# Altium schematic sheet ESC_A.SchDoc
size A3; SheetNumber: 7; SheetTotal: 10
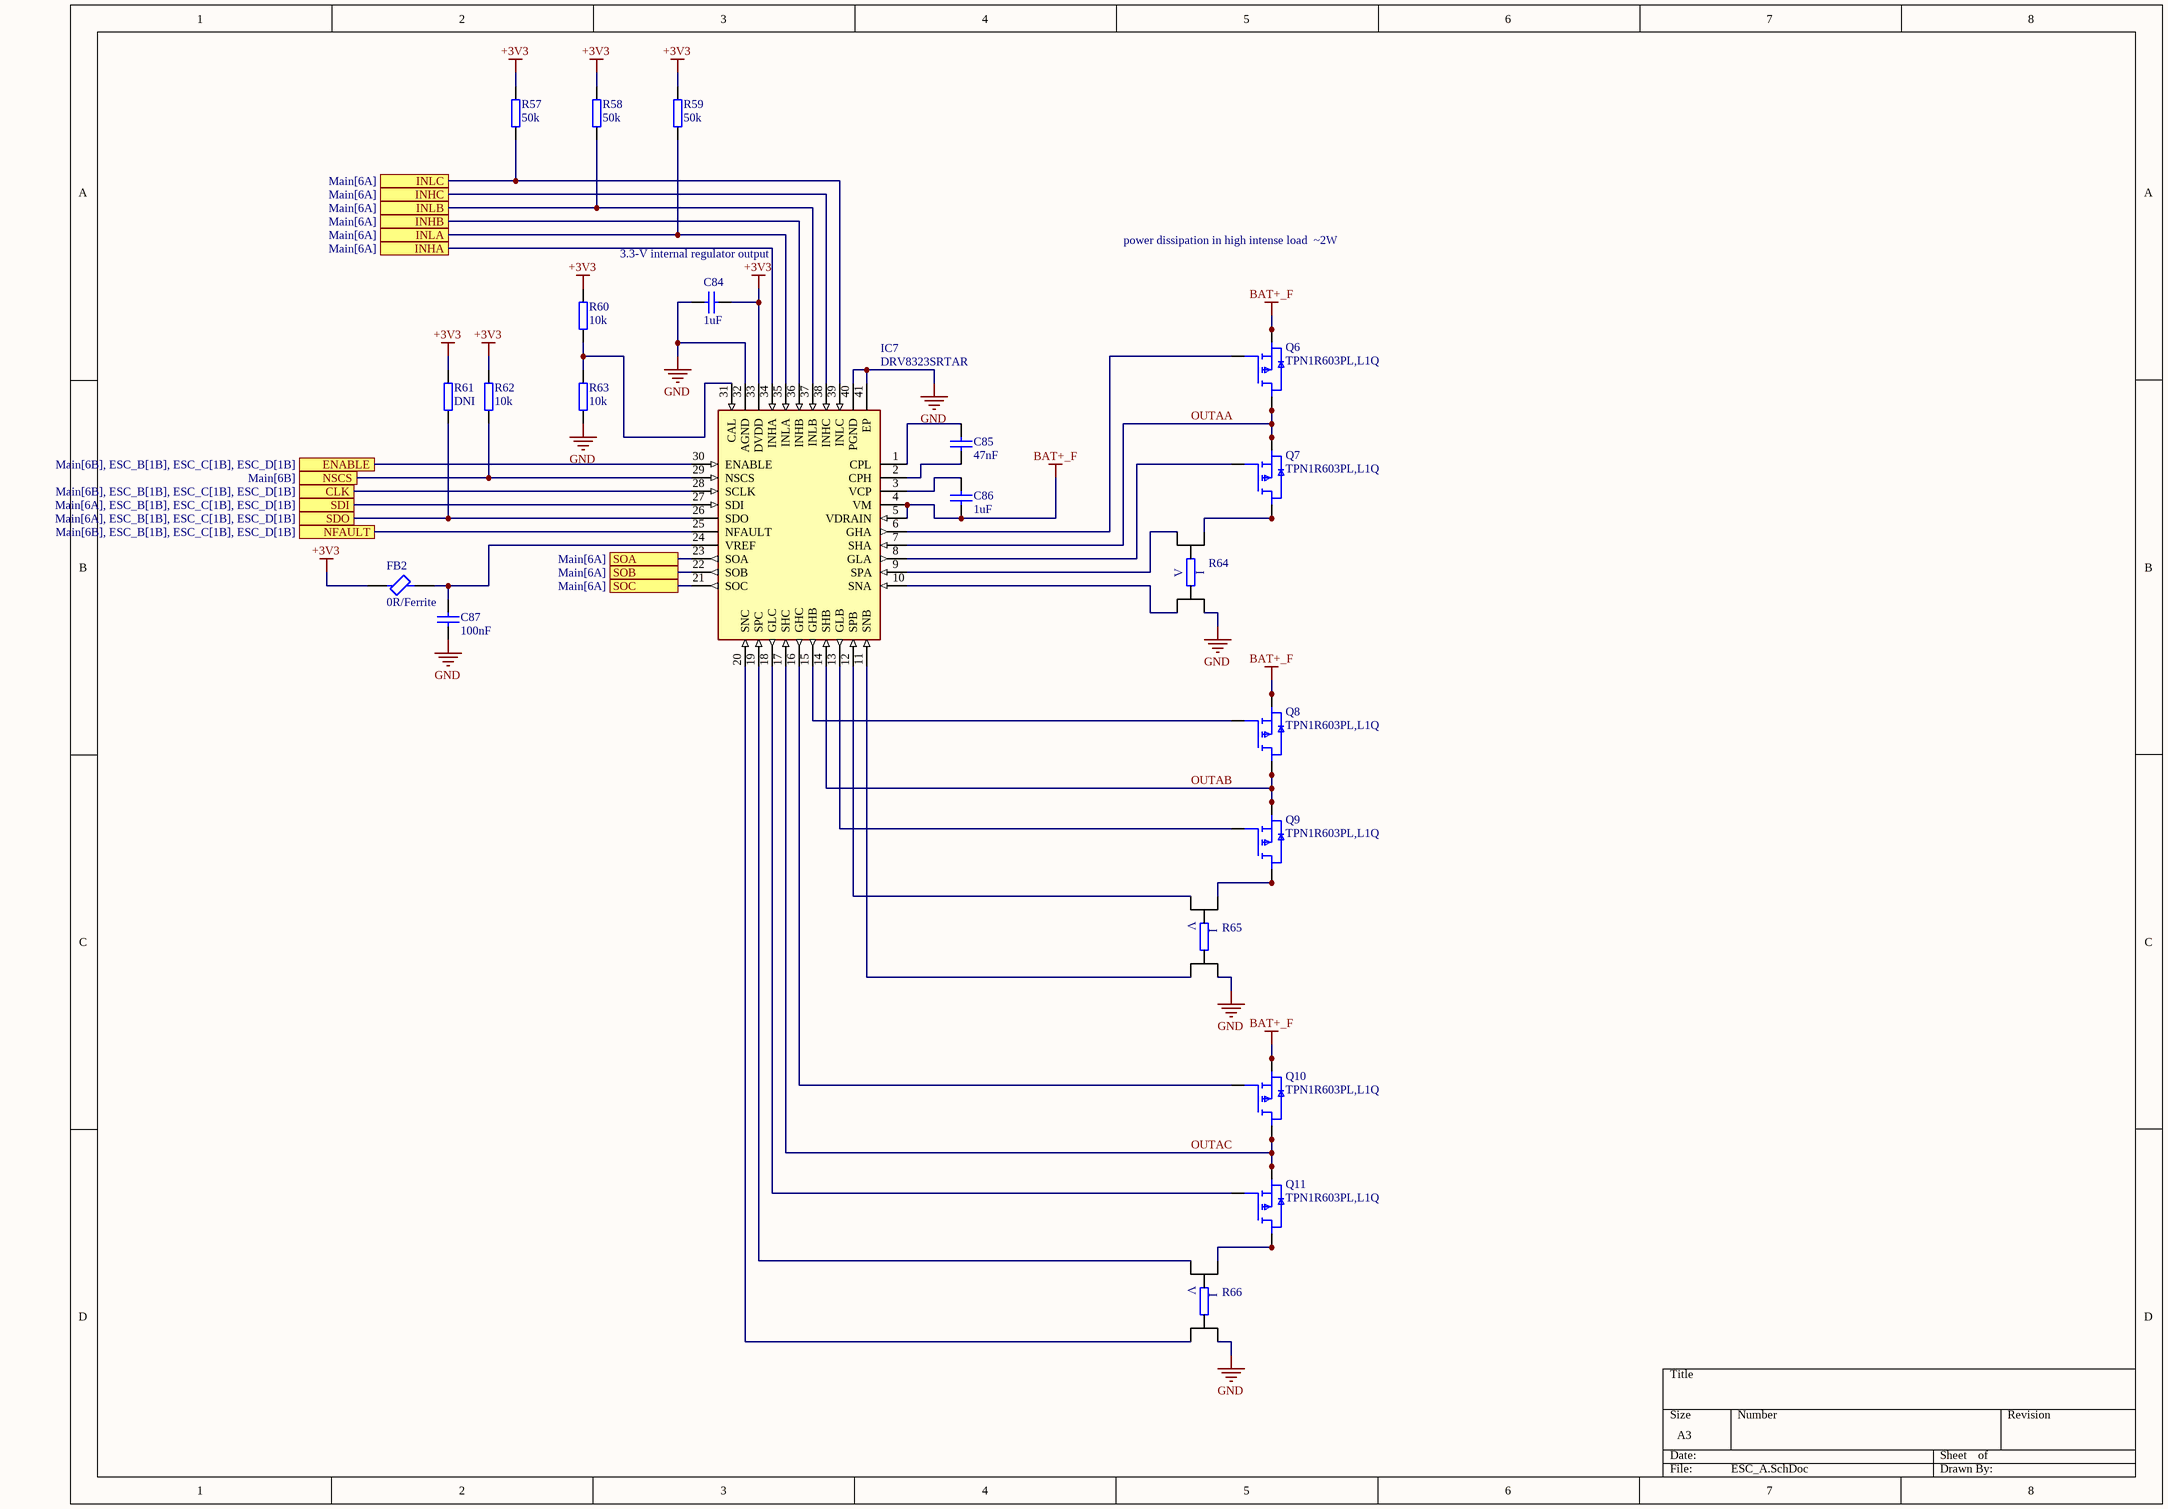
[diagram p0: ESC_A.SchDoc]

## Parts
C84  value 1uF  [CAP0402]  (hidden comment: Cap0402)
C85  value 47nF  [CAP0603]  (hidden comment: Cap0603)
C86  value 1uF  [CAP0603]  (hidden comment: Cap0603)
C87  value 100nF  [CAP0402]  (hidden comment: Cap0402)
FB2  0R/Ferrite  [NFZ15SG152SN10B]
IC7  DRV8323SRTAR  [QFN50P600X600X80-41N-D]
Q6  TPN1R603PL,L1Q  [TPN1R603PLL1Q]
Q7  TPN1R603PL,L1Q  [TPN1R603PLL1Q]
Q8  TPN1R603PL,L1Q  [TPN1R603PLL1Q]
Q9  TPN1R603PL,L1Q  [TPN1R603PLL1Q]
Q10  TPN1R603PL,L1Q  [TPN1R603PLL1Q]
Q11  TPN1R603PL,L1Q  [TPN1R603PLL1Q]
R57  value 50k  [RES0402]  (hidden comment: Res0402)
R58  value 50k  [RES0402]  (hidden comment: Res0402)
R59  value 50k  [RES0402]  (hidden comment: Res0402)
R60  value 10k  [RES0402]  (hidden comment: Res0402)
R61  value DNI  [RES0402]  (hidden comment: Res0402)
R62  value 10k  [RES0402]  (hidden comment: Res0402)
R63  value 10k  [RES0402]  (hidden comment: Res0402)
R64  WSK12161L000FEA  [WSK12161L000FEA]  (value not drawn)
R65  WSK12161L000FEA  [WSK12161L000FEA]  (value not drawn)
R66  WSK12161L000FEA  [WSK12161L000FEA]  (value not drawn)

## Ports
CLK (see Main[6B], ESC_B[1B], ESC_C[1B], ESC_D[1B]), ENABLE (see Main[6B], ESC_B[1B], ESC_C[1B], ESC_D[1B]), INHA (see Main[6A]), INHB (see Main[6A]), INHC (see Main[6A]), INLA (see Main[6A]), INLB (see Main[6A]), INLC (see Main[6A]), NFAULT (see Main[6B], ESC_B[1B], ESC_C[1B], ESC_D[1B]), NSCS (see Main[6B]), SDI (see Main[6A], ESC_B[1B], ESC_C[1B], ESC_D[1B]), SDO (see Main[6A], ESC_B[1B], ESC_C[1B], ESC_D[1B]), SOA (see Main[6A]), SOB (see Main[6A]), SOC (see Main[6A])

## Nets
+3V3: C84.2 FB2.1 IC7.33(DVDD) R57.2 R58.2 R59.2 R60.2 R61.2 R62.2
BAT+_F: C86.1 IC7.4(VM) IC7.5(VDRAIN) Q6.1(S_1) Q6.2(S_2) Q6.3(S_3) Q8.1(S_1) Q8.2(S_2) Q8.3(S_3) Q10.1(S_1) Q10.2(S_2) Q10.3(S_3)
GND: C84.1 C87.1 IC7.32(AGND) IC7.40(PGND) IC7.41(EP) R63.1 R64.1 R65.4 R66.4
CLK: IC7.28(SCLK) ; port CLK
ENABLE: IC7.30(ENABLE) ; port ENABLE
INHA: IC7.34(INHA) ; port INHA
INHB: IC7.36(INHB) ; port INHB
INHC: IC7.38(INHC) ; port INHC
INLA: IC7.35(INLA) R59.1 ; port INLA
INLB: IC7.37(INLB) R58.1 ; port INLB
INLC: IC7.39(INLC) R57.1 ; port INLC
NFAULT: IC7.25(NFAULT) ; port NFAULT
NSCS: IC7.29(NSCS) R62.1 ; port NSCS
OUTAA: IC7.7(SHA) Q6.5(D_1) Q6.6(D_2) Q6.7(D_3) Q6.8(D_4) Q6.9(D_4) Q7.1(S_1) Q7.2(S_2) Q7.3(S_3)
OUTAB: IC7.14(SHB) Q8.5(D_1) Q8.6(D_2) Q8.7(D_3) Q8.8(D_4) Q8.9(D_4) Q9.1(S_1) Q9.2(S_2) Q9.3(S_3)
OUTAC: IC7.17(SHC) Q10.5(D_1) Q10.6(D_2) Q10.7(D_3) Q10.8(D_4) Q10.9(D_4) Q11.1(S_1) Q11.2(S_2) Q11.3(S_3)
SDI: IC7.27(SDI) ; port SDI
SDO: IC7.26(SDO) R61.1 ; port SDO
SOA: IC7.23(SOA) ; port SOA
SOB: IC7.22(SOB) ; port SOB
SOC: IC7.21(SOC) ; port SOC
NetC85_1: C85.1 IC7.2(CPH)
NetC85_2: C85.2 IC7.1(CPL)
NetC86_2: C86.2 IC7.3(VCP)
NetC87_2: C87.2 FB2.2 IC7.24(VREF)
NetIC7_6: IC7.6(GHA) Q6.4(G)
NetIC7_8: IC7.8(GLA) Q7.4(G)
NetIC7_9: IC7.9(SPA) R64.3
NetIC7_10: IC7.10(SNA) R64.2
NetIC7_11: IC7.11(SNB) R65.3
NetIC7_12: IC7.12(SPB) R65.2
NetIC7_13: IC7.13(GLB) Q9.4(G)
NetIC7_15: IC7.15(GHB) Q8.4(G)
NetIC7_16: IC7.16(GHC) Q10.4(G)
NetIC7_18: IC7.18(GLC) Q11.4(G)
NetIC7_19: IC7.19(SPC) R66.2
NetIC7_20: IC7.20(SNC) R66.3
NetIC7_31: IC7.31(CAL) R60.1 R63.2
NetQ7_5: Q7.5(D_1) Q7.6(D_2) Q7.7(D_3) Q7.8(D_4) Q7.9(D_4) R64.4
NetQ9_5: Q9.5(D_1) Q9.6(D_2) Q9.7(D_3) Q9.8(D_4) Q9.9(D_4) R65.1
NetQ11_5: Q11.5(D_1) Q11.6(D_2) Q11.7(D_3) Q11.8(D_4) Q11.9(D_4) R66.1

## Notes on the sheet
- power dissipation in high intense load  ~2W
- 3.3-V internal regulator output
- (near IC7) Separate grounds?
- (in symbol WSK1216L5000FEA) I; V

## Library data of the parts
C84 = Cap0402: Manufacturer_Part_Number: GRM155R61H105KE05J; Voltage: 50V
C85 C86 = CapSMD0603: 50V; Published: 8-Jun-2000; LatestRevisionDate: 29-May-2009; LatestRevisionNote: IPC-7351 Footprint Added.; PackageReference: C1206; Publisher: Altium Limited; PackageDescription: Chip Capacitor
C87 = Cap0402: Manufacturer_Part_Number: GRM155R71H104ME14D; Voltage: 50V
FB2 = BLM15PE471SH1D: Ferrite Bead; Manufacturer_Name: Murata Electronics; Datasheet Link: https://www.murata.com/en-global/products/productdetail.aspx?cate=luNoiseSupprFilteChipFerriBead&partno=BLM15PE471SH1%23; Height: 0.55mm; Manufacturer_Part_Number: BLM15PE471SH1D; Mouser Part Number: 81-BLM15PE471SH1D; Mouser Price/Stock: https://www.mouser.co.uk/ProductDetail/Murata-Electronics/BLM15PE471SH1D?qs=DRkmTr78QATAY5qAVx1hGA%3D%3D
IC7 = DRV8323SRTAR: Integrated Circuit; Manufacturer_Name: Texas Instruments; Datasheet Link: http://www.ti.com/lit/ds/symlink/drv8323.pdf; Height: 0.8mm; Manufacturer_Part_Number: DRV8323SRTAR; Mouser Part Number: 595-DRV8323SRTAR; Mouser Price/Stock: https://www.mouser.co.uk/ProductDetail/Texas-Instruments/DRV8323SRTAR?qs=u4fy%2FsgLU9P2gpPTX6mffg%3D%3D; Arrow Part Number: DRV8323SRTAR; Arrow Price/Stock: https://www.arrow.com/en/products/drv8323srtar/texas-instruments?utm_currency=USD&region=nac
Q6-Q11 = TPN1R603PL,L1Q: MOSFET (N-Channel); Manufacturer_Name: Toshiba; Datasheet Link: https://toshiba.semicon-storage.com/ap-en/semiconductor/product/mosfets/12v-300v-mosfets/detail.TPN1R603PL.html; Height: 0.9mm; Manufacturer_Part_Number: TPN1R603PL,L1Q; Mouser Part Number: 757-TPN1R603PLL1Q; Mouser Price/Stock: https://www.mouser.co.uk/ProductDetail/Toshiba/TPN1R603PLL1Q?qs=bUPhaerQQeGYpGlYi%252BLguw%3D%3D; Arrow Part Number: TPN1R603PL,L1Q; Arrow Price/Stock: https://www.arrow.com/en/products/tpn1r603pll1q/toshiba?utm_currency=USD&region=nac
R57-R59 = Res0402: Manufacturer_Part_Number: TNPW040249K9DEED
R60 R62 R63 = Res0402: Manufacturer_Part_Number: ERA-2AED103X
R64-R66 = WSK1216L5000FEA: Resistor; Manufacturer_Name: Vishay; Datasheet Link: http://www.vishay.com/docs/30189/wsk1216.pdf; Height: 1.9mm; Manufacturer_Part_Number: WSK1216L5000FEA; Mouser Part Number: 71-WSK1216L5000FEA; Mouser Price/Stock: https://www.mouser.co.uk/ProductDetail/Vishay-Dale/WSK1216L5000FEA?qs=OlC7AqGiEDlM2wGD42LFoQ%3D%3D; Arrow Part Number: WSK1216L5000FEA; Arrow Price/Stock: https://www.arrow.com/en/products/wsk1216l5000fea/vishay?region=nac